# EAGLE design main (EAGLE 9.5.2)
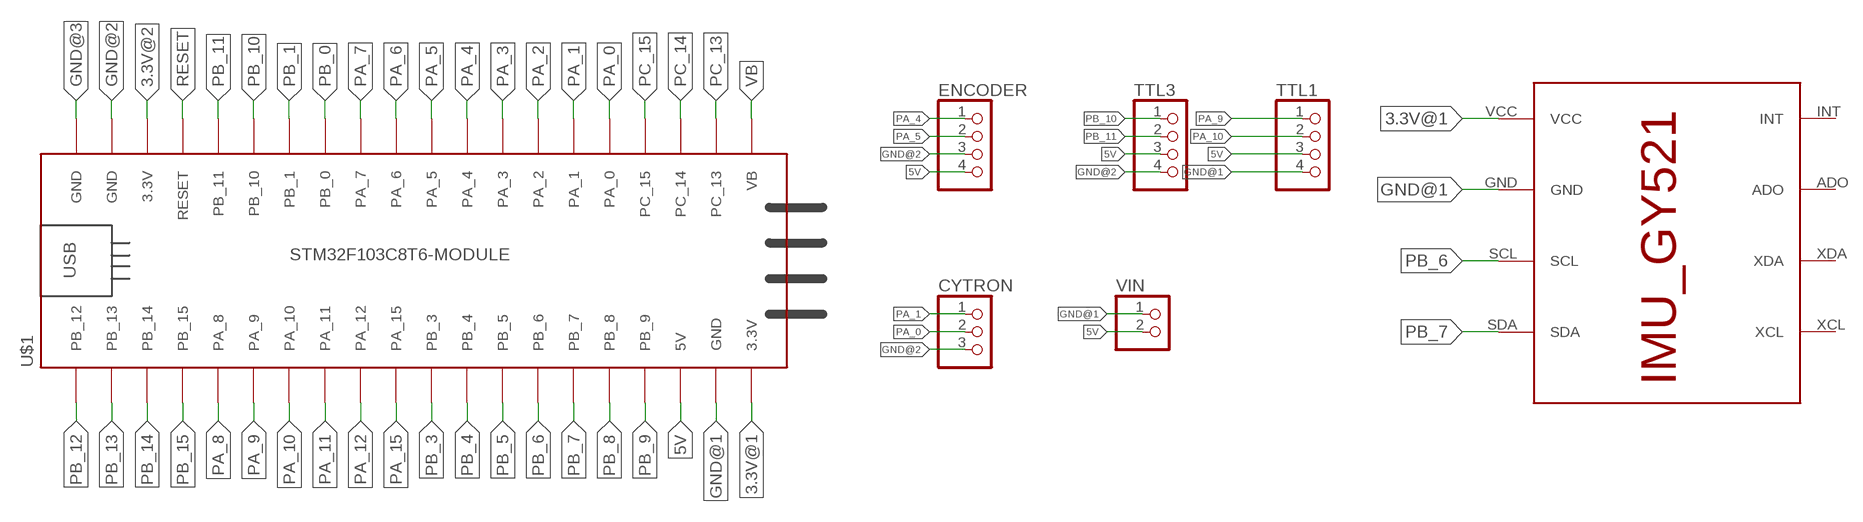
[diagram p0: schematic, sheet 1]

## Parts
CYTRON  PINHD-3_DATA  [1X03_DATA]
ENCODER  PINHD-4_DATA  [1X04_DATA]
IMU  IMU_ROBOCON_GY521  [IMU_GY521]
TTL1  PINHD-4_DATA  [1X04_DATA]
TTL3  PINHD-4_DATA  [1X04_DATA]
U$1  STM32F103C8T6-MODULE  [STM32F103C8T6-MODULE]
VIN  PINHD-2_DATA  [1X02_DATA]

## Nets
3.3V@1: IMU.VCC U$1.3.3V_1(3.3V)
3.3V@2: U$1.3.3V_2(3.3V)
5V: ENCODER.4 TTL1.3 TTL3.3 U$1.5V VIN.2
GND@1: IMU.GND TTL1.4 U$1.GND_1(GND) VIN.1
GND@2: CYTRON.3 ENCODER.3 TTL3.4 U$1.GND_2(GND)
GND@3: U$1.GND_3(GND)
PA_0: CYTRON.2 U$1.PA_0
PA_1: CYTRON.1 U$1.PA_1
PA_2: U$1.PA_2
PA_3: U$1.PA_3
PA_4: ENCODER.1 U$1.PA_4
PA_5: ENCODER.2 U$1.PA_5
PA_6: U$1.PA_6
PA_7: U$1.PA_7
PA_8: U$1.PA_8
PA_9: TTL1.1 U$1.PA_9
PA_10: TTL1.2 U$1.PA_10
PA_11: U$1.PA_11
PA_12: U$1.PA_12
PA_15: U$1.PA_15
PB_0: U$1.PB_0
PB_1: U$1.PB_1
PB_3: U$1.PB_3
PB_4: U$1.PB_4
PB_5: U$1.PB_5
PB_6: IMU.SCL U$1.PB_6
PB_7: IMU.SDA U$1.PB_7
PB_8: U$1.PB_8
PB_9: U$1.PB_9
PB_10: TTL3.1 U$1.PB_10
PB_11: TTL3.2 U$1.PB_11
PB_12: U$1.PB_12
PB_13: U$1.PB_13
PB_14: U$1.PB_14
PB_15: U$1.PB_15
PC_13: U$1.PC_13
PC_14: U$1.PC_14
PC_15: U$1.PC_15
RESET: U$1.RESET
VB: U$1.VB
Unconnected: IMU.ADO IMU.INT IMU.XCL IMU.XDA

## Library data of the parts
CYTRON = MIA_LIBRARY-2-2-2:PINHD-3_DATA: PIN HEADER
ENCODER TTL1 TTL3 = MIA_LIBRARY-2-2-2:PINHD-4_DATA: PIN HEADER
IMU = MIA_LIBRARY-2-2-2:IMU_ROBOCON_GY521
U$1 = MIA_LIBRARY-2-2-2:STM32F103C8T6-MODULE: STM32F103C8T6 module with ARM Cortex-3, 20kB SRAM, 64kB Flash, 72MHz
VIN = MIA_LIBRARY-2-2-2:PINHD-2_DATA: PIN HEADER

## Board
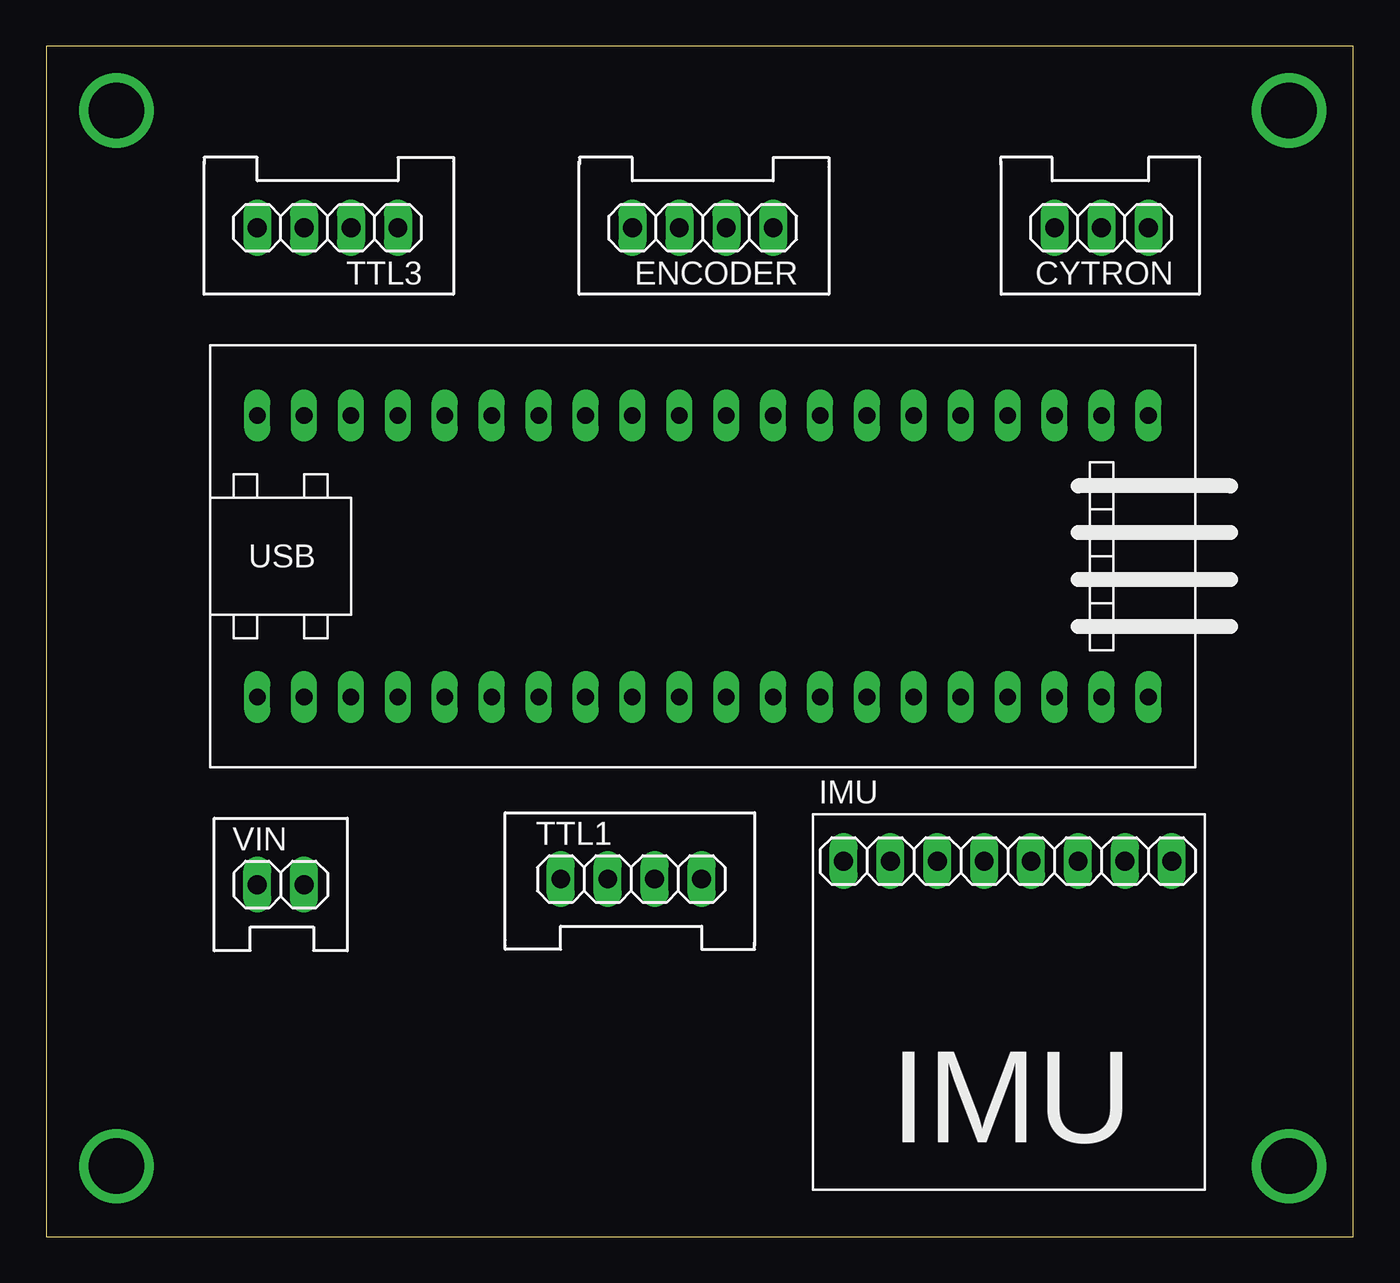
[diagram p1: board, top side]
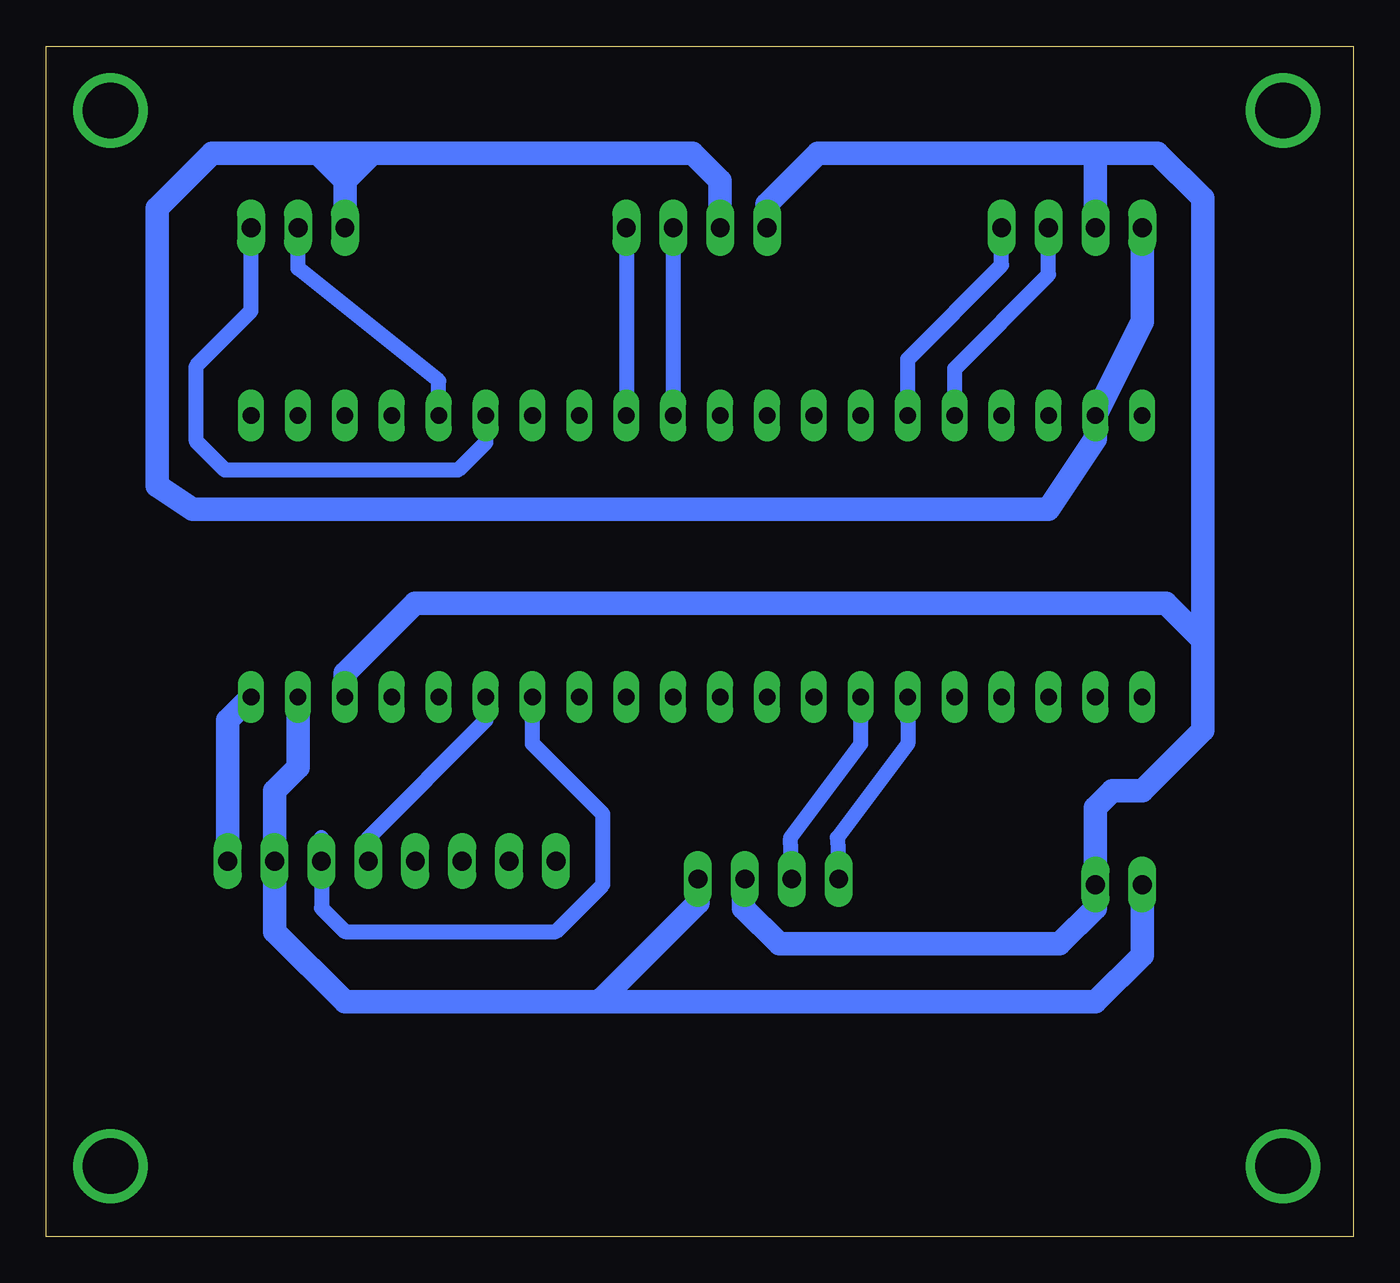
[diagram p2: board, bottom side, seen from below]

Size 70.79 x 64.44 mm. Coordinates in mm from the lower left corner, seen from the top.
Outline: 0,0 70.79,0 70.79,64.44 0,64.44 0,0
Copper layers (1*16): Top 0.035mm / dielectric 1.5mm / Bottom 0.035mm
Design rules "default *": minimum track width 0.8mm, minimum drill 1mm, track to track 0.6mm, track to pad 0.6mm, pad to pad 0.6mm, via to via 0.6mm, smd to smd 0.6mm, copper to edge 1mm, drill to drill 0.8mm, minimum pad ring 10mil, minimum via ring 8mil, stop-mask expansion 4mil, vias tented up to drill 0mil, thermal gap 10mil

### Footprints (pad centres in the part's own frame; a part is rotated, then mirrored left to right if it is on the bottom)
1X03_DATA = drill 1.016 long: 1 -2.54,0; 2 0,0; 3 2.54,0
1X04_DATA = drill 1.016 long: 1 -3.81,0; 2 -1.27,0; 3 1.27,0; 4 3.81,0
IMU_GY521 = drill 1.016 long: ADO -6.35,0; GND 6.35,0; INT -8.89,0; SCL 3.81,0; SDA 1.27,0; VCC 8.89,0; XCL -3.81,0; XDA -1.27,0
STM32F103C8T6-MODULE = drill 0.9 long: 3.3V_1 25.4,-7.62; 3.3V_2 -17.78,7.62; 5V 20.32,-7.62; GND_1 22.86,-7.62; GND_2 -20.32,7.62; GND_3 -22.86,7.62; PA_0 15.24,7.62; PA_1 12.7,7.62; PA_2 10.16,7.62; PA_3 7.62,7.62; PA_4 5.08,7.62; PA_5 2.54,7.62; PA_6 0,7.62; PA_7 -2.54,7.62; PA_8 -12.7,-7.62; PA_9 -10.16,-7.62; PA_10 -7.62,-7.62; PA_11 -5.08,-7.62; PA_12 -2.54,-7.62; PA_15 0,-7.62; PB_0 -5.08,7.62; PB_1 -7.62,7.62; PB_3 2.54,-7.62; PB_4 5.08,-7.62; PB_5 7.62,-7.62; PB_6 10.16,-7.62; PB_7 12.7,-7.62; PB_8 15.24,-7.62; PB_9 17.78,-7.62; PB_10 -10.16,7.62; PB_11 -12.7,7.62; PB_12 -22.86,-7.62; PB_13 -20.32,-7.62; PB_14 -17.78,-7.62; PB_15 -15.24,-7.62; PC_13 22.86,7.62; PC_14 20.32,7.62; PC_15 17.78,7.62; RESET -15.24,7.62; VB 25.4,7.62
1X02_DATA = drill 1.016 long: 1 -1.27,0; 2 1.27,0

### Placement (x,y rotation side)
CYTRON  57.15,54.61 180 top
ENCODER  35.56,54.61 180 top
IMU  52.07,20.32 0 top
TTL1  31.68,19.35 0 top
TTL3  15.24,54.61 180 top
U$1  34.29,36.83 0 top
VIN  12.7,19.05 0 top

### Tracks (layer width: path | path; a pad name or v marks a point on that pad's centre or on a via)
3.3V@1
  Bottom 1.27: U$1.3.3V_1 60.96,27.94 IMU.VCC
5V
  Bottom 1.27: 13.97,58.64 28.99,58.64 31.75,55.88 ENCODER.4 | 13.97,58.64 10.6,58.64 8.16,56.2 8.16,31.75 | U$1.5V 54.61,30.48 50.8,34.29 10.16,34.29 8.16,32.29 8.16,27.4 11.43,24.13 13.06,24.13 13.97,23.22 VIN.2 13.97,17.78 15.91,15.84 31.08,15.84 33.02,17.78 33.02,19.28 TTL1.3 | TTL3.3 13.97,58.64
GND@1
  Bottom 1.27: U$1.GND_1 57.15,25.4 58.42,24.13 IMU.GND 58.42,16.51 54.61,12.7 40.64,12.7 | TTL1.4 35.49,18.08 40.64,12.93 40.64,12.7 | VIN.1 11.43,15.24 13.97,12.7 40.64,12.7
GND@2
  Bottom 1.27: CYTRON.3 54.61,57.15 | 56.1,58.64 61.79,58.64 64.77,55.66 64.77,40.64 62.87,39.37 16.51,39.37 13.97,43.18 U$1.GND_2 11.43,49.53 TTL3.4 | 54.61,57.15 56.1,58.64 | ENCODER.3 34.29,57.15 35.78,58.64 53.12,58.64 | 54.61,57.15 53.12,58.64 | 56.1,58.64 53.12,58.64
N$1  (via drill 3 pad 3)
  other vias: 67.31,3.81
N$2  (via drill 3 pad 3)
  other vias: 67.31,60.96
N$3  (via drill 3 pad 3)
  other vias: 3.81,60.96
N$4  (via drill 3 pad 3)
  other vias: 3.81,3.81
PA_0
  Bottom 0.8: U$1.PA_0 49.53,46.31 57.15,52.41 CYTRON.2
PA_1
  Bottom 0.8: CYTRON.1 59.69,50.1 62.66,47.13 62.66,43.04 61.11,41.48 48.48,41.48 46.99,42.98 U$1.PA_1
PA_4
  Bottom 0.8: ENCODER.1 U$1.PA_4
PA_5
  Bottom 0.8: 36.83,53.34 ENCODER.2 U$1.PA_5
PA_9
  Bottom 0.8: 24.13,27.94 U$1.PA_9 24.13,26.67 27.94,21.59 TTL1.1
PA_10
  Bottom 0.8: TTL1.2 30.48,21.59 26.67,26.67 U$1.PA_10
PB_6
  Bottom 0.8: 55.88,21.59 IMU.SCL 55.88,17.78 54.61,16.51 43.18,16.51 40.64,19.05 40.64,22.86 44.45,26.67 U$1.PB_6
PB_7
  Bottom 0.8: U$1.PB_7 46.99,27.94 53.34,21.59 IMU.SDA
PB_10
  Bottom 0.8: U$1.PB_10 24.13,47.5 19.05,52.58 TTL3.1
PB_11
  Bottom 0.8: U$1.PB_11 21.59,46.99 16.51,52.07 TTL3.2